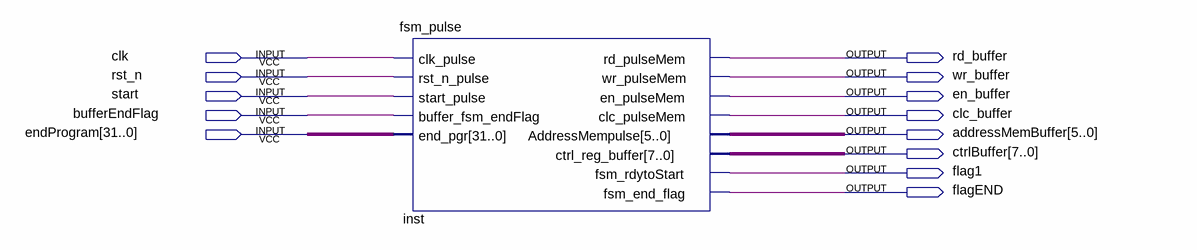
[diagram p0: schematic sheet]
// Quartus schematic pgrFSM.bdf as structural Verilog: 1 symbols, 13 pins
module pgrFSM (
  input  clk,
  input  rst_n,
  input  start,
  input  bufferEndFlag,
  input  [31:0] endProgram,
  output rd_buffer,
  output wr_buffer,
  output en_buffer,
  output clc_buffer,
  output [5:0] addressMemBuffer,
  output [7:0] ctrlBuffer,
  output flag1,
  output flagEND
);

  fsm_pulse inst (
    .clk_pulse(clk), .rst_n_pulse(rst_n), .start_pulse(start), .buffer_fsm_endFlag(bufferEndFlag),
    .end_pgr(endProgram), .rd_pulseMem(rd_buffer), .wr_pulseMem(wr_buffer), .en_pulseMem(en_buffer),
    .clc_pulseMem(clc_buffer), .AddressMempulse(addressMemBuffer), .ctrl_reg_buffer(ctrlBuffer),
    .fsm_rdytoStart(flag1), .fsm_end_flag(flagEND));
endmodule
